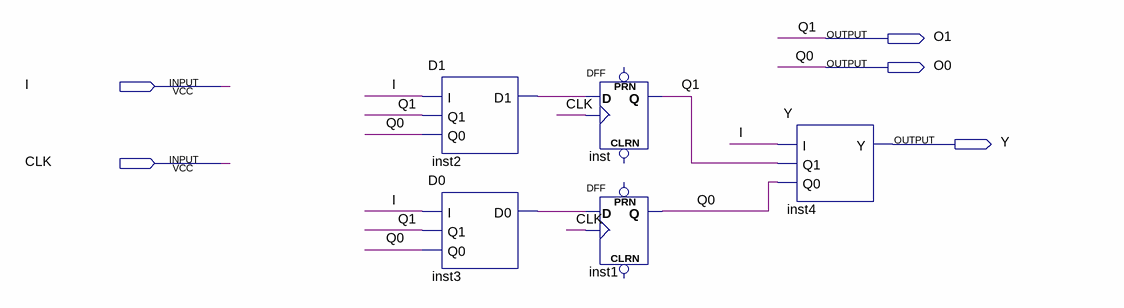
[diagram p0: schematic sheet]
// Quartus schematic MEALY.bdf as structural Verilog: 5 symbols, 5 pins
module MEALY (
  input  I,
  input  CLK,
  output O1,
  output O0,
  output Y
);

  wire inst2_d1, inst3_d0;

  D1 inst2 (.I(I), .Q1(O1), .Q0(O0), .D1(inst2_d1));
  D0 inst3 (.I(I), .Q1(O1), .Q0(O0), .D0(inst3_d0));
  DFF inst (.CLK(CLK), .D(inst2_d1), .Q(O1));  // open: CLRN, PRN
  DFF inst1 (.CLK(CLK), .D(inst3_d0), .Q(O0));  // open: CLRN, PRN
  Y inst4 (.I(I), .Q1(O1), .Q0(O0), .Y(Y));

  // Other names for the same wires on the sheet: Q0 = O0; Q1 = O1
endmodule
